# Altium schematic sheet Top.SchDoc
size A
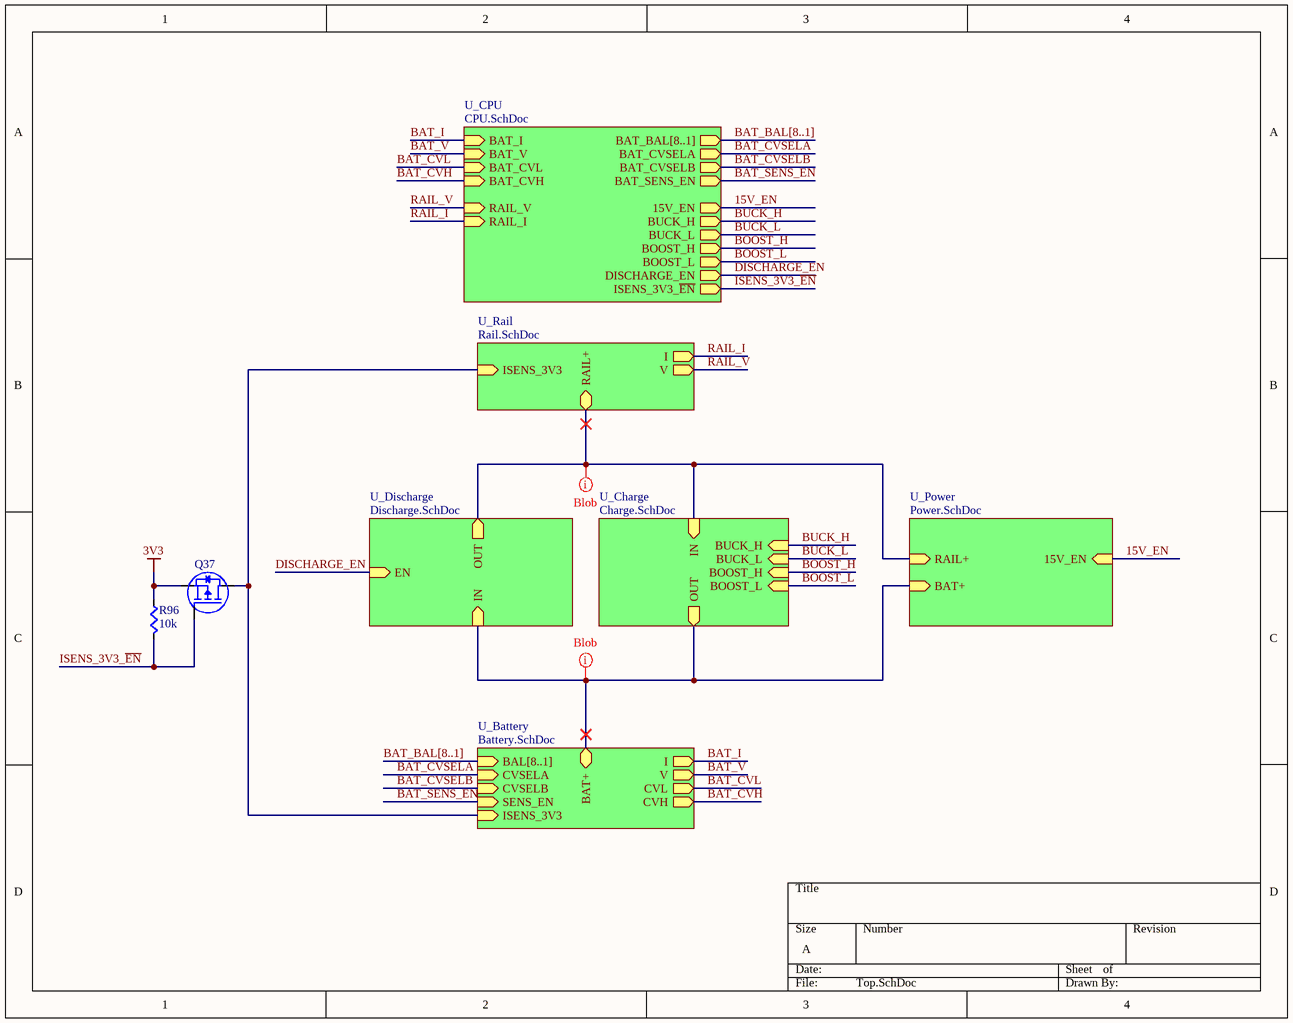
[diagram p0: Top.SchDoc]

## Parts
Q37  FDN5618P  [PowerSOT-3]  (value not drawn)
R96  value 10k  [RES0603]  (hidden comment: Res)

## Sub-sheets
U_Battery = Battery.SchDoc: V (out), BAT+ (bidir), I (out), BAL[8..1] (in), CVL (out), CVH (out), CVSELA (in), CVSELB (in), SENS_EN (in), ISENS_3V3 (in)
U_Charge = Charge.SchDoc: BOOST_L (in), BOOST_H (in), OUT (out), BUCK_L (in), BUCK_H (in), IN (in)
U_CPU = CPU.SchDoc: BAT_I (in), BAT_V (in), BAT_CVL (in), BAT_CVH (in), RAIL_V (in), RAIL_I (in), BAT_BAL[8..1] (out), BUCK_L (out), BUCK_H (out), BOOST_L (out), BOOST_H (out), BAT_CVSELA (out), BAT_CVSELB (out), DISCHARGE_EN (out), BAT_SENS_EN (out), 15V_EN (out), ISENS_3V3_~{EN} (out)
U_Discharge = Discharge.SchDoc: EN (in), IN (in), OUT (out)
U_Power = Power.SchDoc: 15V_EN (in), RAIL+ (in), BAT+ (in)
U_Rail = Rail.SchDoc: I (out), V (out), RAIL+ (bidir), ISENS_3V3 (in)

## Nets
3V3: Q37.S R96.1(A)
15V_EN: sheet U_Power/15V_EN, sheet U_CPU/15V_EN
BAT_CVH: sheet U_Battery/CVH, sheet U_CPU/BAT_CVH
BAT_CVL: sheet U_Battery/CVL, sheet U_CPU/BAT_CVL
BAT_CVSELA: sheet U_Battery/CVSELA, sheet U_CPU/BAT_CVSELA
BAT_CVSELB: sheet U_Battery/CVSELB, sheet U_CPU/BAT_CVSELB
BAT_I: sheet U_Battery/I, sheet U_CPU/BAT_I
BAT_SENS_EN: sheet U_Battery/SENS_EN, sheet U_CPU/BAT_SENS_EN
BAT_V: sheet U_Battery/V, sheet U_CPU/BAT_V
BOOST_H: sheet U_Charge/BOOST_H, sheet U_CPU/BOOST_H
BOOST_L: sheet U_Charge/BOOST_L, sheet U_CPU/BOOST_L
BUCK_H: sheet U_Charge/BUCK_H, sheet U_CPU/BUCK_H
BUCK_L: sheet U_Charge/BUCK_L, sheet U_CPU/BUCK_L
DISCHARGE_EN: sheet U_Discharge/EN, sheet U_CPU/DISCHARGE_EN
ISENS_3V3_~{EN}: Q37.G R96.2(B) ; sheet U_CPU/ISENS_3V3_~{EN}
RAIL_I: sheet U_Rail/I, sheet U_CPU/RAIL_I
RAIL_V: sheet U_Rail/V, sheet U_CPU/RAIL_V
NetQ37_D: Q37.D ; sheet U_Battery/ISENS_3V3, sheet U_Rail/ISENS_3V3
(unnamed): sheet U_Battery/BAT+, sheet U_Power/BAT+, sheet U_Discharge/IN, sheet U_Charge/OUT
(unnamed): sheet U_Rail/RAIL+, sheet U_Power/RAIL+, sheet U_Discharge/OUT, sheet U_Charge/IN

## Buses and harness runs
bus BAT_BAL[8..1] = sheet U_Battery/BAL[8..1]
bus BAT_BAL[8..1] = sheet U_CPU/BAT_BAL[8..1]

## Layout directives
net class Blob: (no net found under the mark)

## Library data of the parts
Q37 = FDN5618P: 60V P-Channel Logic Level PowerTrench MOSFET; Supplier 1: Digi-Key; Supplier Part Number 1: FDN5618PCT-ND
R96 = Res: Supplier 1: Digi-Key; Supplier Part Number 1: RMCF0603JT10K0CT-ND